# EAGLE design telemetry (EAGLE 8.3.2)
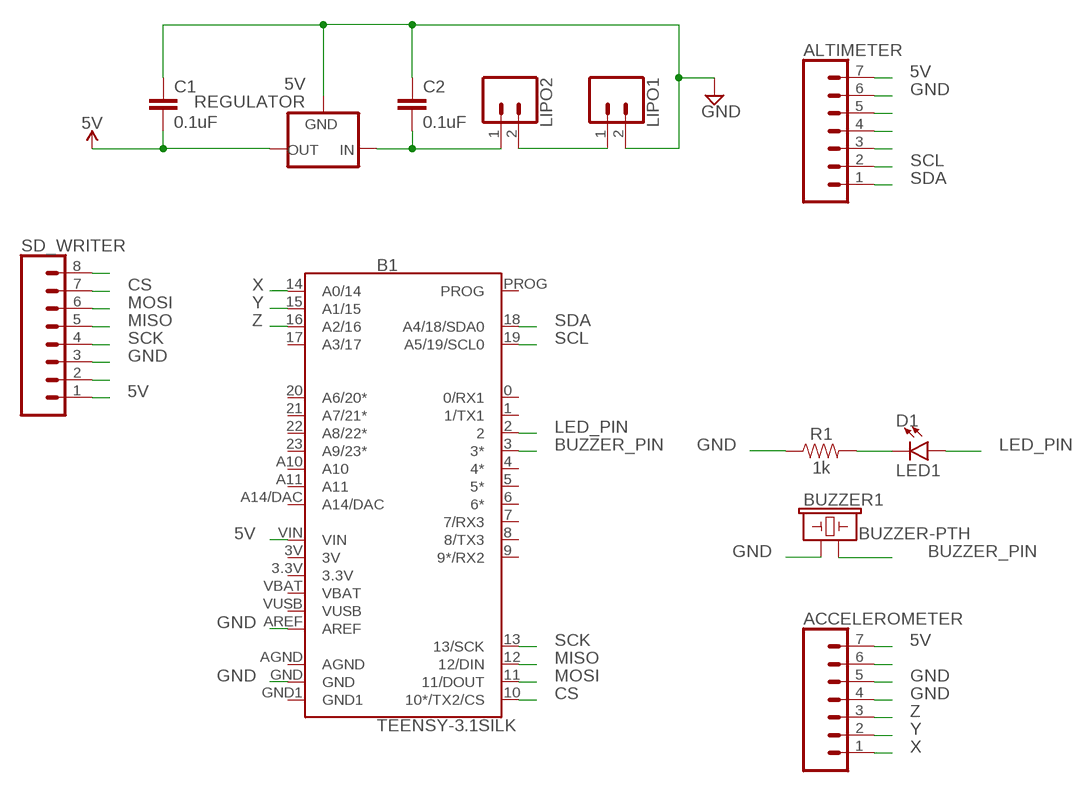
[diagram p0: schematic, sheet 1]

## Parts
ACCELEROMETER  CONN_07  [1X07]
ALTIMETER  CONN_07  [1X07]
B1  TEENSY-3.1SILK  [TEENSY-3.1]
BUZZER1  BUZZER-PTH  [BUZZER-12MM]
C1  0.1uF  0.1UF-KIT-EZ-50V-20%  [CAP-PTH-SMALL-KIT]
C2  0.1uF  0.1UF-KIT-EZ-50V-20%  [CAP-PTH-SMALL-KIT]
D1  LED1  LED5MM  [LED_5MM]
LIPO1  CONN_02  [1X02]
LIPO2  CONN_02  [1X02]
R1  1k  1KOHM-HORIZ-1/4W-1%  [AXIAL-0.3]
REGULATOR  5V  78XXS  [78XXS]
SD_WRITER  CONN_08"  [1X08]

## Nets
5V: ACCELEROMETER.7 ALTIMETER.7 B1.VIN C1.2 REGULATOR.OUT SD_WRITER.1
BUZZER_PIN: B1.3(3*) BUZZER1.-
CS: B1.10(10*/TX2/CS) SD_WRITER.7
GND: ACCELEROMETER.4 ACCELEROMETER.5 ALTIMETER.6 B1.AREF B1.GND BUZZER1.+ C1.1 C2.1 LIPO1.2 R1.P$1 REGULATOR.GND SD_WRITER.3
LED_PIN: B1.2 D1.A
MISO: B1.12(12/DIN) SD_WRITER.5
MOSI: B1.11(11/DOUT) SD_WRITER.6
N$1: LIPO1.1 LIPO2.2
N$2: SD_WRITER.8
N$3: C2.2 LIPO2.1 REGULATOR.IN
N$4: D1.K(C) R1.P$2
N$5: ACCELEROMETER.6
N$8: ALTIMETER.3
N$9: ALTIMETER.4
N$10: ALTIMETER.5
N$11: SD_WRITER.2
SCK: B1.13(13/SCK) SD_WRITER.4
SCL: ALTIMETER.2 B1.19(A5/19/SCL0)
SDA: ALTIMETER.1 B1.18(A4/18/SDA0)
X: ACCELEROMETER.1 B1.14(A0/14)
Y: ACCELEROMETER.2 B1.15(A1/15)
Z: ACCELEROMETER.3 B1.16(A2/16)
Unconnected: B1.0(0/RX1) B1.1(1/TX1) B1.4(4*) B1.5(5*) B1.6(6*) B1.7(7/RX3) B1.8(8/TX3) B1.9(9*/RX2) B1.17(A3/17) B1.20(A6/20*) B1.21(A7/21*) B1.22(A8/22*) B1.23(A9/23*) B1.A10 B1.A11 B1.A14/DAC B1.PROG

## Power pins joined to a net without a drawn wire
3.3V: B1.3.3V
3V: B1.3V
AGND: B1.AGND
GND1: B1.GND1
VBAT: B1.VBAT
VUSB: B1.VUSB

## Library data of the parts
ACCELEROMETER ALTIMETER = SparkFun-Connectors:CONN_07: Multi connection point. Often used as Generic Header-pin footprint for 0.1 inch spaced/style header connections On any of the 0.1 inch spaced packages, you can populate with these: Break Away Headers - Straight <https://www.sparkfun.com/products/116> (PRT-00116) Break Away Male Headers - Right Angle <https://www.sparkfun.com/products/553> (PRT-00553) Female Headers <https://www.sparkfun.com/products/115> (PRT-00115) Break Away Headers - Machine Pin <https://www.sparkfun.com/products/117> (PRT-00117) Break Away Female Headers - Swiss Machine Pin <https://www.sparkfun.com/products/743> (PRT-00743) For SCREWTERMINALS and SPRING TERMINALS visit here: Screw Terimnals on SparkFun.com <https://www.sparkfun.com/search/results?term=Screw+Terminals> (5mm/3.5mm/2.54mm spacing) This device is also useful as a general connection point to wire up your design to another part of your project. Our various solder wires solder well into these plated through hole pads. Hook-Up Wire - Assortment (Stranded, 22 AWG) <https://www.sparkfun.com/products/11375> (PRT-11375) Hook-Up Wire - Assortment (Solid Core, 22 AWG) <https://www.sparkfun.com/products/11367> (PRT-11367) View the entire wire category on our website here <https://www.sparkfun.com/categories/141> Special notes: Molex polarized connector foot print use with SKU : PRT-08231 with associated crimp pins and housings. 1MM SMD Version SKU: PRT-10208 NOTES ON THE VARIANTS LOCK and LOCK_LONGPADS... This footprint was designed to help hold the alignment of a through-hole component (i.e. 6-pin header) while soldering it into place. You may notice that each hole has been shifted either up or down by 0.005 of an inch from it's more standard position (which is a perfectly straight line). This slight alteration caused the pins (the squares in the middle) to touch the edges of the holes. Because they are alternating, it causes a "brace" to hold the component in place. 0.005 has proven to be the perfect amount of "off-center" position when using our standard breakaway headers. Although looks a little odd when you look at the bare footprint, once you have a header in there, the alteration is very hard to notice. Also,if you push a header all the way into place, it is covered up entirely on the bottom side.
B1 = SparkFun-Boards:TEENSY-3.1: Teensy 3+ Footprint Mechanical footprint with connectors for Teensy Development Board with ARM Cortex. SparkFun Products: Teensy 3.2 <https://www.sparkfun.com/products/13736> Teensy LC <https://www.sparkfun.com/products/13305>; SF_ID: DEV-12646
BUZZER1 = SparkFun-Electromechanical:BUZZER: Buzzer Small round buzzers that operate around the audible 2kHz range. You can use these as speakers to create simple music or user interfaces. Variant Overview: PTH - Mini Speaker - PC Mount 12mm 2.048kHz <https://www.sparkfun.com/products/7950> PTH_KIT - Mini Speaker - PC Mount 12mm 2.048kHz <https://www.sparkfun.com/products/7950> KIT simplifies soldering by adding stop mask to one side of the pads. PTH_NO_SILK - Mini Speaker - PC Mount 12mm 2.048kHz <https://www.sparkfun.com/products/7950> No silkscreen indicator of buzzer outline. PTH_KIT_NO_SILK - Mini Speaker - PC Mount 12mm 2.048kHz <https://www.sparkfun.com/products/7950> KIT package w/o silkscreen SMD - Buzzer Audio Magnetic (CCV-084B16) SMD buzzer used on, e.g. the LilyPad Buzzer <https://www.sparkfun.com/products/8463> and RFID USB Reader <https://www.sparkfun.com/products/9963>. SMD_KIT - Buzzer Audio Magnetic (CCV-084B16) SMD Buzzer with elongated pins to make soldering easier. Used on the SparkFun Simon Says - Surface Mount Soldering Kit <https://www.sparkfun.com/products/10935>.; PROD_ID: COMP-08253; SF_SKU: COM-07950
C1 C2 = SparkFun-Capacitors:0.1UF: 0.1µF ceramic capacitors A capacitor is a passive two-terminal electrical component used to store electrical energy temporarily in an electric field.; PROD_ID: CAP-08370
D1 = SparkFun-LED:LED: LED (Generic) Standard schematic elements and footprints for 5mm, 3mm, 1206, and 0603 sized LEDs. Generic LEDs with no color specified.
LIPO1 LIPO2 = SparkFun-Connectors:CONN_02: Multi connection point. Often used as Generic Header-pin footprint for 0.1 inch spaced/style header connections On any of the 0.1 inch spaced packages, you can populate with these: Break Away Headers - Straight <https://www.sparkfun.com/products/116> (PRT-00116) Break Away Male Headers - Right Angle <https://www.sparkfun.com/products/553> (PRT-00553) Female Headers <https://www.sparkfun.com/products/115> (PRT-00115) Break Away Headers - Machine Pin <https://www.sparkfun.com/products/117> (PRT-00117) Break Away Female Headers - Swiss Machine Pin <https://www.sparkfun.com/products/743> (PRT-00743) For SCREWTERMINALS and SPRING TERMINALS visit here: Screw Terimnals on SparkFun.com <https://www.sparkfun.com/search/results?term=Screw+Terminals> (5mm/3.5mm/2.54mm spacing) This device is also useful as a general connection point to wire up your design to another part of your project. Our various solder wires solder well into these plated through hole pads. Hook-Up Wire - Assortment (Stranded, 22 AWG) <https://www.sparkfun.com/products/11375> (PRT-11375) Hook-Up Wire - Assortment (Solid Core, 22 AWG) <https://www.sparkfun.com/products/11367> (PRT-11367) View the entire wire category on our website here <https://www.sparkfun.com/categories/141> Special notes: Molex polarized connector foot print use with: PRT-08233 with associated crimp pins and housings. 2.54_SCREWTERM for use with PRT-10571. 3.5mm Screw Terminal footprints for PRT-08084 5mm Screw Terminal footprints for use with PRT-08432
R1 = SparkFun-Resistors:1KOHM: 1kΩ resistor A resistor is a passive two-terminal electrical component that implements electrical resistance as a circuit element. Resistors act to reduce current flow, and, at the same time, act to lower voltage levels within circuits. - Wikipedia; PROD_ID: RES-12182
REGULATOR = v-reg:78XXS: VOLTAGE REGULATOR
SD_WRITER = SparkFun-Connectors:CONN_08: Multi connection point. Often used as Generic Header-pin footprint for 0.1 inch spaced/style header connections On any of the 0.1 inch spaced packages, you can populate with these: Break Away Headers - Straight <https://www.sparkfun.com/products/116> (PRT-00116) Break Away Male Headers - Right Angle <https://www.sparkfun.com/products/553> (PRT-00553) Female Headers <https://www.sparkfun.com/products/115> (PRT-00115) Break Away Headers - Machine Pin <https://www.sparkfun.com/products/117> (PRT-00117) Break Away Female Headers - Swiss Machine Pin <https://www.sparkfun.com/products/743> (PRT-00743) Arduino Stackable Header - 8 Pin <https://www.sparkfun.com/products/9279> (PRT-09279) For SCREWTERMINALS and SPRING TERMINALS visit here: Screw Terimnals on SparkFun.com <https://www.sparkfun.com/search/results?term=Screw+Terminals> (5mm/3.5mm/2.54mm spacing) This device is also useful as a general connection point to wire up your design to another part of your project. Our various solder wires solder well into these plated through hole pads. Hook-Up Wire - Assortment (Stranded, 22 AWG) <https://www.sparkfun.com/products/11375> (PRT-11375) Hook-Up Wire - Assortment (Solid Core, 22 AWG) <https://www.sparkfun.com/products/11367> (PRT-11367) View the entire wire category on our website here <https://www.sparkfun.com/categories/141> Special notes: Molex polarized connector foot print use with SKU : PRT-08231 with associated crimp pins and housings. 1MM SMD Version SKU: PRT-10208 NOTES ON THE VARIANTS LOCK and LOCK_LONGPADS... This footprint was designed to help hold the alignment of a through-hole component (i.e. 6-pin header) while soldering it into place. You may notice that each hole has been shifted either up or down by 0.005 of an inch from it's more standard position (which is a perfectly straight line). This slight alteration caused the pins (the squares in the middle) to touch the edges of the holes. Because they are alternating, it causes a "brace" to hold the component in place. 0.005 has proven to be the perfect amount of "off-center" position when using our standard breakaway headers. Although looks a little odd when you look at the bare footprint, once you have a header in there, the alteration is very hard to notice. Also,if you push a header all the way into place, it is covered up entirely on the bottom side.; PROD_ID: CONN-08438

## Net classes
0 default: width 0.5 mm, drill 0.5 mm, clearance 0.5 mm

## Board
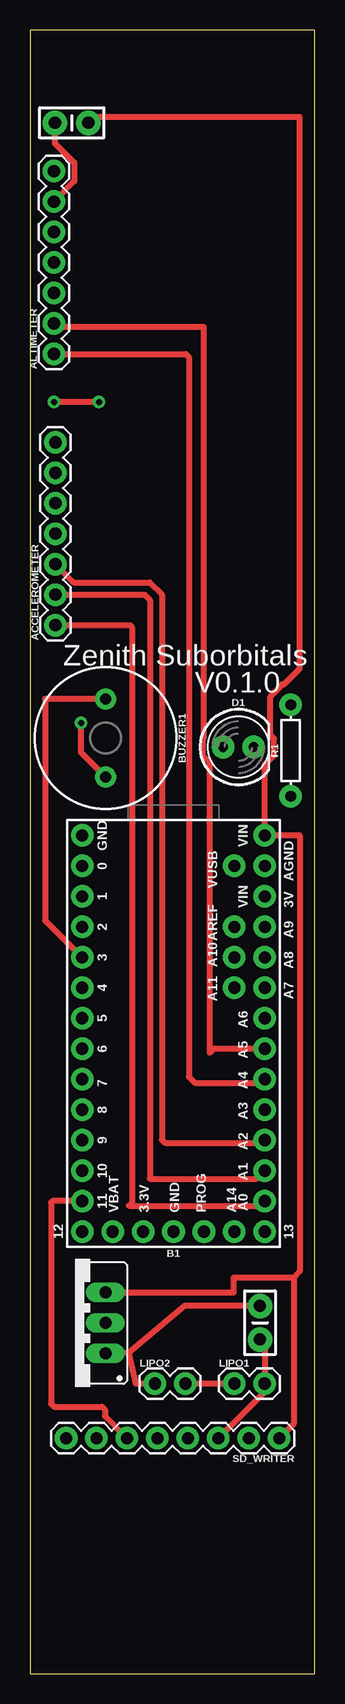
[diagram p1: board, top side]
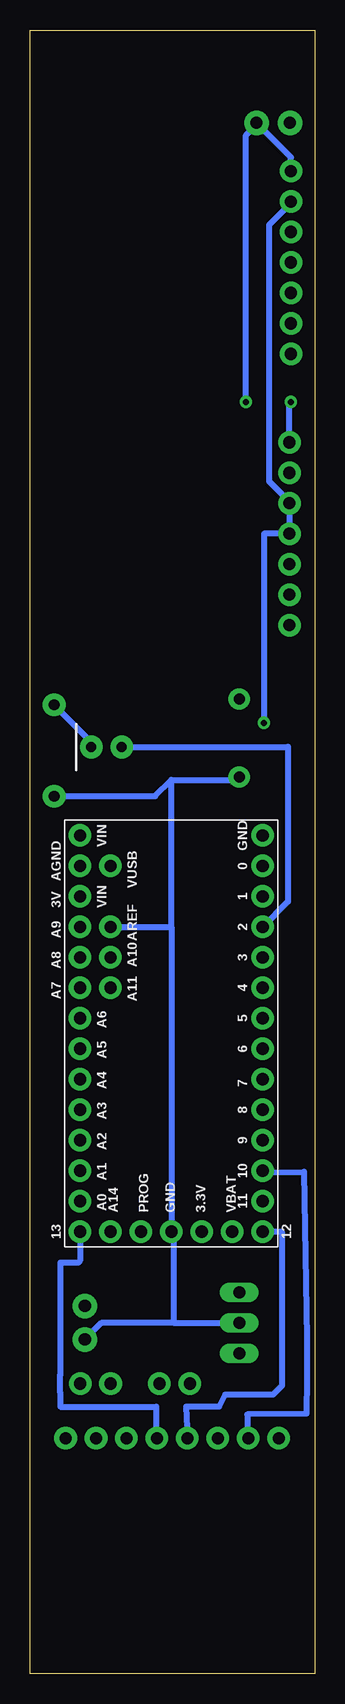
[diagram p2: board, bottom side, seen from below]

Size 23.78 x 137 mm. Coordinates in mm from the lower left corner, seen from the top.
Outline: 0,0 23.78,0 23.78,137 0,137 0,0
Copper layers (1*16): Top 0.035mm / dielectric 1.5mm / Bottom 0.035mm
Design rules "SparkFun *": minimum track width 8mil, minimum drill 18mil, track to track 8mil, track to pad 8mil, pad to pad 8mil, via to via 8mil, smd to smd 8mil, copper to edge 8mil, drill to drill 8mil, minimum pad ring 12mil, minimum via ring 10mil, stop-mask expansion 4mil, vias tented up to drill 20mil, thermal gap 10mil

### Footprints (pad centres in the part's own frame; a part is rotated, then mirrored left to right if it is on the bottom)
1X07 = drill 1.016 pad 1.88: 1 0,0; 2 2.54,0; 3 5.08,0; 4 7.62,0; 5 10.16,0; 6 12.7,0; 7 15.24,0
TEENSY-3.1 = drill 1.016 pad 1.88: 0 7.62,-13.97; 1 7.62,-11.43; 2 7.62,-8.89; 3 7.62,-6.35; 3.3V 2.54,16.51; 3V -7.62,-11.43; 4 7.62,-3.81; 5 7.62,-1.27; 6 7.62,1.27; 7 7.62,3.81; 8 7.62,6.35; 9 7.62,8.89; 10 7.62,11.43; 11 7.62,13.97; 12 7.62,16.51; 13 -7.62,16.51; 14 -7.62,13.97; 15 -7.62,11.43; 16 -7.62,8.89; 17 -7.62,6.35; 18 -7.62,3.81; 19 -7.62,1.27; 20 -7.62,-1.27; 21 -7.62,-3.81; 22 -7.62,-6.35; 23 -7.62,-8.89; A10 -5.08,-6.35; A11 -5.08,-3.81; A14/DAC -5.08,16.51; AGND -7.62,-13.97; AREF -5.08,-8.89; GND 0,16.51; GND1 7.62,-16.51; PROG -2.54,16.51; VBAT 5.08,16.51; VIN -7.62,-16.51; VUSB -5.08,-13.97
BUZZER-12MM = drill 0.9 pad 1.778: + 3.25,0; - -3.25,0
CAP-PTH-SMALL-KIT = drill 1.016 pad 2.032: 1 -1.397,0; 2 1.397,0
LED_5MM = drill 0.813 pad 1.88: A -1.27,0; K 1.27,0
1X02 = drill 1.016 pad 1.88: 1 0,0; 2 2.54,0
AXIAL-0.3 = drill 0.9 pad 1.88: P$1 -3.81,0; P$2 3.81,0
78XXS = drill 1.016 long: GND 0,-2.54; IN -2.54,-2.54; OUT 2.54,-2.54
1X08 = drill 1.016 pad 1.88: 1 0,0; 2 2.54,0; 3 5.08,0; 4 7.62,0; 5 10.16,0; 6 12.7,0; 7 15.24,0; 8 17.78,0

### Placement (x,y rotation side)
ACCELEROMETER  2.13,87.39 90 top
ALTIMETER  2,110 90 top
B1  11.98,53.35 180 top
BUZZER1  6.31,77.98 270 top
C1  3.48,129.26 0 top
C2  19.2,29.24 90 top
D1  17.4,77.23 0 top
LIPO1  17.05,24.16 0 top
LIPO2  10.43,24.16 0 top
R1  21.76,76.94 90 top
REGULATOR  3.77,29.22 90 top
SD_WRITER  20.8,19.61 180 top

### Tracks (layer width: path | path; a pad name or v marks a point on that pad's centre or on a via)
5V  (via drill 0.5)
  Top 0.508: REGULATOR.OUT 16.99,31.76 17,31.75 17,33 22,33 | 22,33 22,20.81 SD_WRITER.1 | 22,33 22.51,33.51 22.51,69.86 B1.VIN 19.6,75.77 20.36,76.53 20.36,77.93 20.07,78.23 20.07,81.45 21.06,82.44 21.19,82.44 22.51,83.76 22.51,129.74 22.5,129.75 5.37,129.75 C1.2 | v2,106 v5.75,106 6,106
  Bottom 0.508: ALTIMETER.7 2,126.38 4.81,129.19 | 4.81,129.19 C1.2 | ACCELEROMETER.7 2.13,105.88 2.25,106 v2,106 | v5.75,106 5.75,128.25 4.81,129.19
BUZZER_PIN
  Top 0.508: BUZZER1.- 1.27,81.23 1.27,62.79 B1.3
CS
  Bottom 0.508: B1.10 4.36,41.77 0.92,41.83 0.67,27.92 0.67,24.66 0.7,21.66 5.64,21.6 5.64,19.69 SD_WRITER.7
GND  (via drill 0.5)
  Top 0.508: C2.1 19.59,27.45 LIPO1.2 19.59,23.48 SD_WRITER.3 | C1.1 2.08,127.55 3.69,125.94 3.69,124.39 ALTIMETER.6 | v4.25,79.25 4.25,76.79 BUZZER1.+
  Bottom 0.508: 11.75,29.22 REGULATOR.GND | 11.75,29.22 17.82,29.22 C2.1 | 11.75,29.22 11.75,36.61 B1.GND 11.98,62.25 | 11.98,62.25 11.98,74.48 | 11.98,74.48 12,74.5 6.54,74.5 BUZZER1.+ | R1.P$1 13.33,73.13 11.98,74.48 | ALTIMETER.6 2,122.56 3.82,120.73 3.82,99.39 2.13,97.69 ACCELEROMETER.5 ACCELEROMETER.4 4.24,95.01 4.25,95 v4.25,79.25 | B1.AREF 11.99,62.24 11.98,62.25
LED_PIN
  Bottom 0.508: D1.A 2.27,77.23 2.25,77.25 2.25,64.35 B1.2
MISO
  Bottom 0.508: B1.12 2.84,36.84 2.75,36.75 2.75,24 3.5,23.25 7.5,23.25 8,22.25 10.75,22.25 SD_WRITER.5
MOSI
  Top 0.508: B1.11 1.88,39.38 1.75,39.25 1.75,22.5 2,22.25 6,22.25 6.25,22 6.25,21.46 SD_WRITER.6
N$1
  Top 0.508: LIPO1.1 LIPO2.2
N$3
  Top 0.508: LIPO2.1 8.83,24.16 8.24,26.75 | 8.24,26.75 REGULATOR.IN | C2.2 12.89,30.64 8.24,26.75
N$4
  Bottom 0.508: D1.K 18.67,77.66 R1.P$2
SCK
  Bottom 0.508: B1.13 19.6,34.4 19.75,34.25 21.25,34.25 21.25,24.89 21.28,24.86 21.28,23.46 21.25,23.43 21.25,22.25 13.25,22.25 13.25,19.68 SD_WRITER.4
SCL
  Top 0.508: B1.19 15.33,52.08 15,51.75 15,75.97 14.44,76.53 14.44,77.93 14.5,78 14.5,112.25 2.29,112.25 ALTIMETER.2
SDA
  Top 0.508: ALTIMETER.1 13,110 13.25,109.75 13.25,49.75 13.75,49.25 19.31,49.25 B1.18
X
  Top 0.508: ACCELEROMETER.1 8.36,87.39 8.5,87.25 8.5,39.25 8.25,39 19.22,39 B1.14
Y
  Top 0.508: ACCELEROMETER.2 9.57,89.93 10,89.5 10,41.25 18.93,41.25 B1.15
Z
  Top 0.508: ACCELEROMETER.3 3.66,90.94 9.99,90.94 11.01,89.92 11.01,44.49 11.25,44.25 19.39,44.25 B1.16

### Text on the board
tNames: Zenith Suborbitals | V0.1.0